# Altium schematic sheet Power.SchDoc: Power
size A4; DocumentNumber: MB1219; Revision: B.1; SheetNumber: 3; SheetTotal: 17; Project: STM32F769I-EVAL
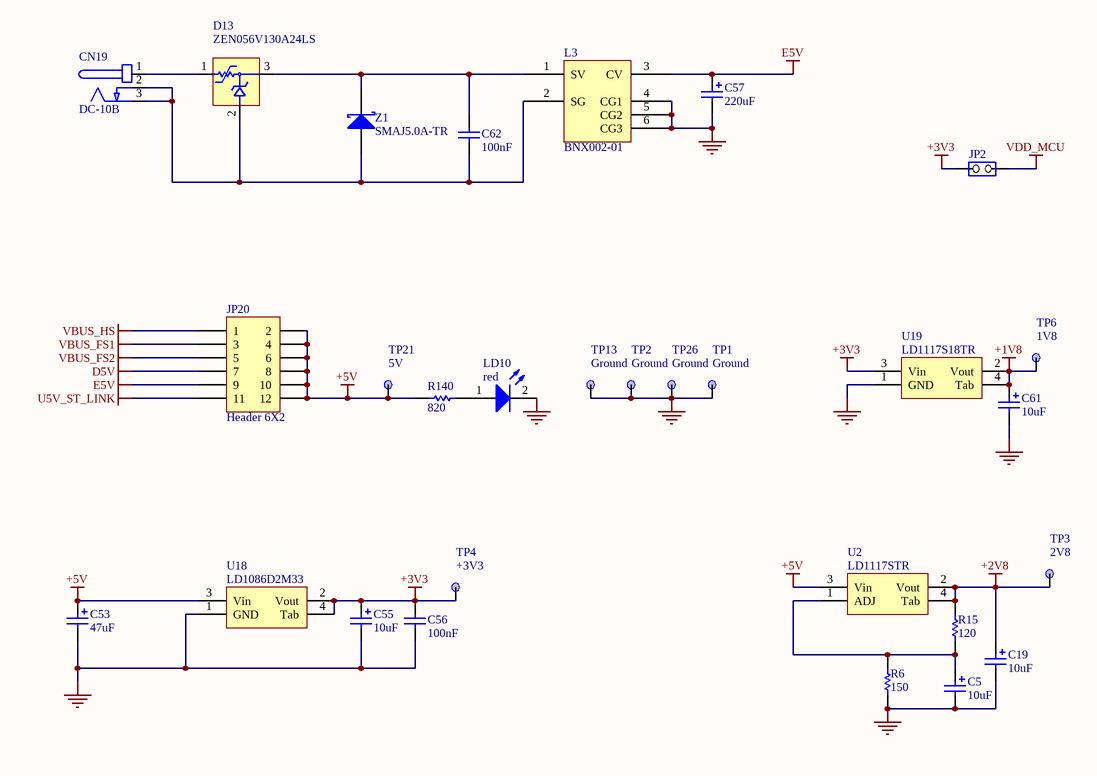
[diagram p0: Power.SchDoc]

## Parts
C5  10uF  [TAN-A]
C19  10uF  [TAN-A]
C53  47uF  [CAE_5R3X5R3_H5R4]
C55  10uF  [TAN-A]
C56  100nF  [0603C]
C57  220uF  [c310m-6]
C61  10uF  [TAN-A]
C62  100nF  [0603C]
CN19  DC-10B  [PWR_JACK_DC10]
D13  ZEN056V130A24LS  [TYCO_ZEN056V130A24LS]
JP2  (no value)  [SIP2]
JP20  Header 6X2  [HDR_2X6_2R54]
L3  BNX002-01  [BNX001]
LD10  red  [0603D]
R6  150  [0603R]
R15  120  [0603R]
R140  820  [0603R]
TP1  Ground  [TP]
TP2  Ground  [TP]
TP3  2V8  [TP]
TP4  +3V3  [TP]
TP6  1V8  [TP]
TP13  Ground  [TP]
TP21  5V  [TP]
TP26  Ground  [TP]
U2  LD1117STR  [SOT-223]
U18  LD1086D2M33  [TO263-3]
U19  LD1117S18TR  [SOT-223]
Z1  SMAJ5.0A-TR  [sma]

## Nets
+1V8: C61.1 TP6.1 U19.2(Vout) U19.4(Tab)
+2V8: C19.1 R15.1 TP3.1 U2.2(Vout) U2.4(Tab)
+3V3: C55.1 C56.1 JP2.1(COMMON) TP4.1 U18.2(Vout) U18.4(Tab) U19.3(Vin)
+5V: C53.1 JP20.2 JP20.4 JP20.6 JP20.8 JP20.10 JP20.12 R140.2 TP21.1 U2.3(Vin) U18.3(Vin)
D5V: JP20.7
E5V: C57.1 JP20.9 L3.3(CV)
GND: C5.2 C19.2 C53.2 C55.2 C56.2 C57.2 C61.2 L3.4(CG1) L3.5(CG2) L3.6(CG3) LD10.2(K) R6.2 TP1.1 TP2.1 TP13.1 TP26.1 U18.1(GND) U19.1(GND)
U5V_ST_LINK: JP20.11
VBUS_FS1: JP20.3
VBUS_FS2: JP20.5
VBUS_HS: JP20.1
VDD_MCU: JP2.2(NO)
NetC5_1: C5.1 R6.1 R15.2 U2.1(ADJ)
NetC62_1: C62.1 D13.3 L3.1(SV) Z1.2(K)
NetC62_2: C62.2 CN19.2(GND) CN19.3(GND) D13.2 L3.2(SG) Z1.1(A)
NetCN19_1: CN19.1(+) D13.1
NetLD10_1: LD10.1(A) R140.1

## Notes on the sheet
- Title:
- Project:
- Size:
- Date:
- A4
- Reference:
- Sheet:
- Revision:
- of

## Library data of the parts
C5 C19 C55 C61 = Cap Pol1: Polarized Capacitor (Radial); Published: 8-Jun-2000; Revision: July-2002: Re-released for DXP Platform.; Publisher: Altium Limited; Value: 10uF
C53 = Cap Pol1: Polarized Capacitor (Radial); Value: 10uF; Published: 8-Jun-2000; Revision: July-2002: Re-released for DXP Platform.; Publisher: Altium Limited
C56 = Cap: Capacitor; Value: 10nF; Published: 8-Jun-2000; Revision: July-2002: Re-released for DXP Platform.; Publisher: Altium Limited
C57 = Cap Pol1: Polarized Capacitor (Radial); Value: 47uF; Published: 8-Jun-2000; Revision: July-2002: Re-released for DXP Platform.; Publisher: Altium Limited
C62 = CAP: Capacitor; Value: 100pF; Published: 8-Jun-2000; Revision: July-2002: Re-released for DXP Platform.; Publisher: Altium Limited
CN19 = PJ202A
JP2 = JP2
JP20 = Header 6X2: Header, 6-Pin, Dual row; Revision: 17-Jul-2002: Re-released for DXP Platform.; Publisher: Altium Limited
L3 = BNX002
LD10 = LED2: Typical RED, GREEN, YELLOW, AMBER GaAs LED; Published: 8-Jun-2000; Revision: July-2002: Re-released for DXP Platform.; Publisher: Altium Limited
R6 R15 R140 = res1: Resistor; Value: 1K; Published: 8-Jun-2000; Revision: July-2002: Re-released for DXP Platform.; Publisher: Altium Limited
TP1-TP4 TP6 TP13 TP21 TP26 = TP
Z1 = D Schottky: Schottky Diode; Code - JEDEC: DO-214-AA; Published: 8-Jun-2000; Revision: July-2002: Re-released for DXP Platform.; Publisher: Altium Limited